# EAGLE board Keyboard_C64_HotSwap (EAGLE 9.6.0)
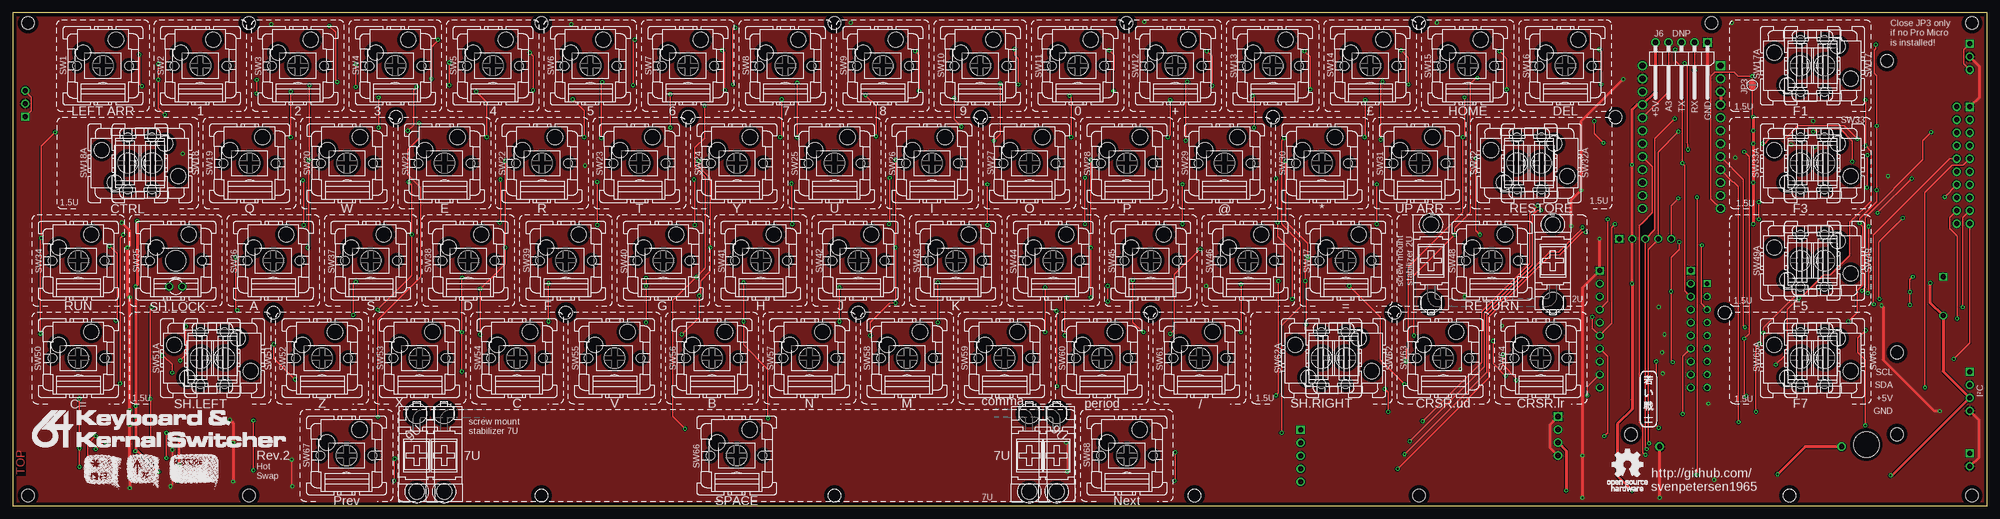
[diagram p1: board, top side]
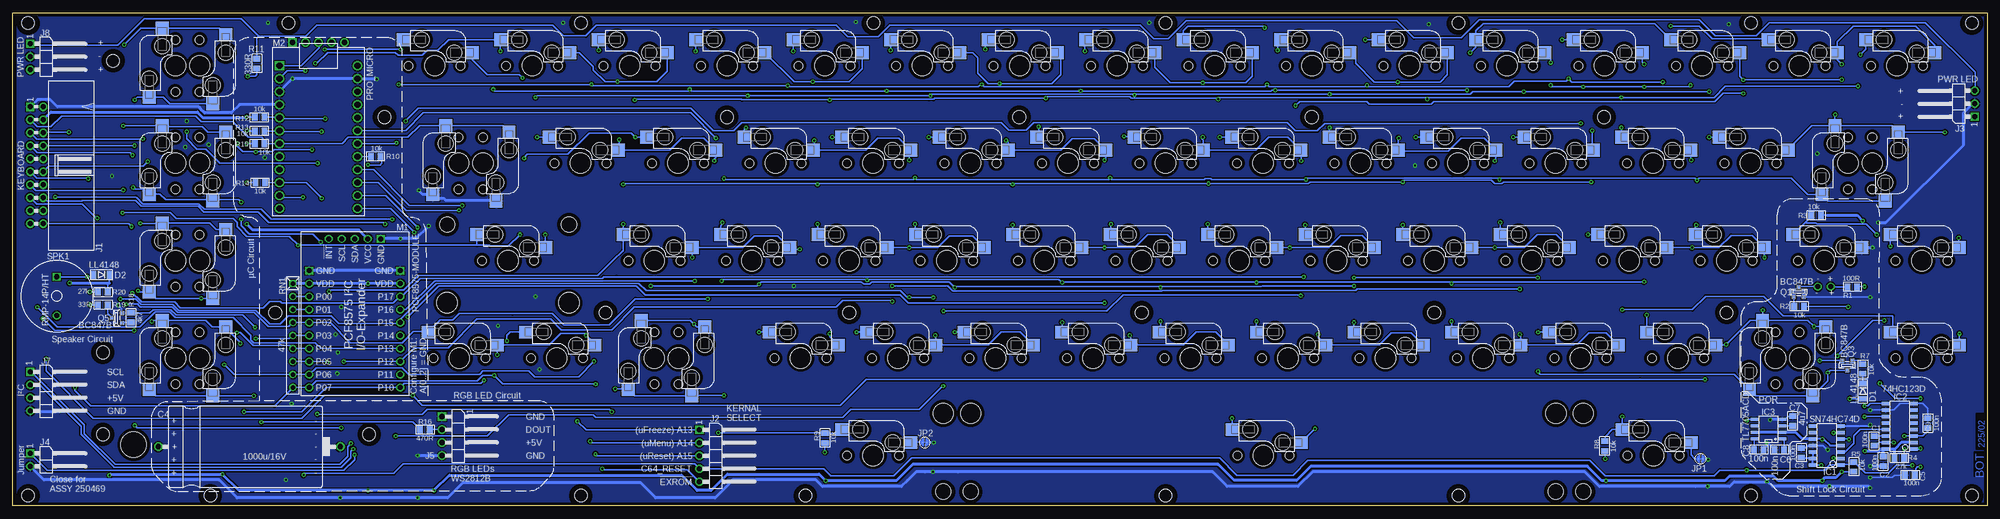
[diagram p2: board, bottom side, seen from below]

Size 385.6 x 96.4 mm. Coordinates in mm from the lower left corner, seen from the top.
Outline: 0,0 385.6,0 385.6,96.4 0,96.4 0,0
Copper layers (1*16): Top 0.035mm / dielectric 1.5mm / Bottom 0.035mm
Design rules "default *": minimum track width 6mil, minimum drill 0.35mm, track to track 6mil, track to pad 6mil, pad to pad 6mil, via to via 6mil, smd to smd 6mil, copper to edge 25mil, drill to drill 6mil, minimum pad ring 10mil, minimum via ring 8mil, stop-mask expansion 4mil, vias tented up to drill 25mil, thermal gap 10mil
Holes 2.5 mm at 3,94.4 3,2 46.16,94.4 103.29,94.4 160.44,94.4 217.52,94.4 274.64,94.4 331.76,94.4 382.6,94.4 46.16,2 103.29,2 160.44,2 274.64,2 347,2 382.6,2 74.8,76 131.92,76 189.04,76 246.14,76 313,76 50.88,37.8 108,37.8 165.12,37.8 222.24,37.8 269.84,37.8 334.34,37.8 230.8,2 366,87 368,30 368,14 316,14
Holes 5 mm at 362,12
tRestrict: area 1,92.4 to 5,96.4; area 44.2,92.4 to 48.2,96.4; area 101.3,92.4 to 105.3,96.4; area 158.4,92.4 to 162.4,96.4; area 215.5,92.4 to 219.5,96.4; area 272.6,92.4 to 276.6,96.4; area 329.8,92.4 to 333.8,96.4; area 380.6,92.4 to 384.6,96.4; area 72.8,74 to 76.8,78; area 129.9,74 to 133.9,78; area 187,74 to 191,78; area 244.1,74 to 248.1,78; area 311,74 to 315,78; area 48.9,35.8 to 52.9,39.8; area 106,35.8 to 110,39.8; area 163.1,35.8 to 167.1,39.8; area 220.2,35.8 to 224.2,39.8; area 267.8,35.8 to 271.8,39.8; area 332.3,35.8 to 336.3,39.8; area 380.6,0 to 384.6,4; area 272.6,0 to 276.6,4; area 158.4,0 to 162.4,4; area 101.3,0 to 105.3,4; area 44.2,0 to 48.2,4; area 1,0 to 5,4; area 345,0 to 349,4; area 82.2,0.8 to 86.2,4.8; area 196.5,0.8 to 200.5,4.8; area 275,53 to 279,57; area 298.8,53 to 302.8,57; area 76.8,0.8 to 80.8,4.8; area 201.8,0.8 to 205.8,4.8; area 228.8,0 to 232.8,4; area 364,85 to 368,89; area 366,28 to 370,32; area 366,12 to 370,16; area 314,12 to 318,16
bRestrict: area 1,92.4 to 5,96.4; area 44.2,92.4 to 48.2,96.4; area 101.3,92.4 to 105.3,96.4; area 158.4,92.4 to 162.4,96.4; area 215.5,92.4 to 219.5,96.4; area 272.6,92.4 to 276.6,96.4; area 329.8,92.4 to 333.8,96.4; area 380.6,92.4 to 384.6,96.4; area 72.8,74 to 76.8,78; area 129.9,74 to 133.9,78; area 187,74 to 191,78; area 244.1,74 to 248.1,78; area 311,74 to 315,78; area 48.9,35.8 to 52.9,39.8; area 106,35.8 to 110,39.8; area 163.1,35.8 to 167.1,39.8; area 220.2,35.8 to 224.2,39.8; area 267.8,35.8 to 271.8,39.8; area 332.3,35.8 to 336.3,39.8; area 380.6,0 to 384.6,4; area 272.6,0 to 276.6,4; area 158.4,0 to 162.4,4; area 101.3,0 to 105.3,4; area 44.2,0 to 48.2,4; area 1,0 to 5,4; area 345,0 to 349,4; area 82.2,0.8 to 86.2,4.8; area 196.5,0.8 to 200.5,4.8; area 275,53 to 279,57; area 298.8,53 to 302.8,57; area 76.8,0.8 to 80.8,4.8; area 201.8,0.8 to 205.8,4.8; area 228.8,0 to 232.8,4; area 364,85 to 368,89; area 366,28 to 370,32; area 366,12 to 370,16; area 314,12 to 318,16; 3 lines

## Footprints (pad centres in the part's own frame; a part is rotated, then mirrored left to right if it is on the bottom)
0805 = smd 1.092 x 1.397: 1 -0.94,0; 2 0.94,0
C30X16L = drill 1.016 pad 1.651: A -17.78,0; K 17.78,0
SOD80C = smd 1 x 1.6: A -1.5,0; K 1.5,0
SO-14 = smd 0.61 x 1.524: 1 -3.81,-2.794; 2 -2.54,-2.794; 3 -1.27,-2.794; 4 0,-2.794; 5 1.27,-2.794; 6 2.54,-2.794; 7 3.81,-2.794; 8 3.81,2.667; 9 2.54,2.667; 10 1.27,2.667; 11 0,2.667; 12 -1.27,2.667; 13 -2.54,2.667; 14 -3.81,2.667
SO-16 = smd 0.61 x 1.524: 1 -3.81,-2.819; 2 -2.54,-2.819; 3 -1.27,-2.819; 4 0,-2.819; 5 1.27,-2.819; 6 2.54,-2.819; 7 3.81,-2.819; 8 5.08,-2.819; 9 5.08,2.692; 10 3.81,2.692; 11 2.54,2.692; 12 1.27,2.692; 13 0,2.692; 14 -1.27,2.692; 15 -2.54,2.692; 16 -3.81,2.692
SO8 = smd 0.6 x 1.5: 1 -1.905,-2.699; 2 -0.635,-2.699; 3 0.635,-2.699; 4 1.905,-2.699; 5 1.905,2.699; 6 0.635,2.699; 7 -0.635,2.699; 8 -1.905,2.699
2X10WH = drill 1 pad 1.626 square: 1 -11.43,-1.27 | drill 1 pad 1.626: 2 -11.43,1.27; 3 -8.89,-1.27; 4 -8.89,1.27; 5 -6.35,-1.27; 6 -6.35,1.27; 7 -3.81,-1.27; 8 -3.81,1.27; 9 -1.27,-1.27; 10 -1.27,1.27; 11 1.27,-1.27; 12 1.27,1.27; 13 3.81,-1.27; 14 3.81,1.27; 15 6.35,-1.27; 16 6.35,1.27; 17 8.89,-1.27; 18 8.89,1.27; 19 11.43,-1.27; 20 11.43,1.27
1X05/90 = drill 1 pad 1.626 square: 1 -5.08,0 | drill 1 pad 1.626: 2 -2.54,0; 3 0,0; 4 2.54,0; 5 5.08,0
1X03/90 = drill 1 pad 1.626 square: 1 -2.54,0 | drill 1 pad 1.626: 2 0,0; 3 2.54,0
1X02/90 = drill 1 pad 1.626 square: 1 -1.27,0 | drill 1 pad 1.626: 2 1.27,0
1X04/90 = drill 1 pad 1.626 square: 1 -3.81,0 | drill 1 pad 1.626: 2 -1.27,0; 3 1.27,0; 4 3.81,0
CP_CL = smd 0.152 x 0.152: 1 -0.4,0; 2 0.4,0
CP_OP = smd 0.152 x 0.152: 1 -0.4,0; 2 0.4,0
PCF8575MODUL = drill 1 square: A1 -8.89,-8.5; B1 8.89,-8.5; C1 -5.08,-14.7 | drill 1: A2 -8.89,-5.96; A3 -8.89,-3.42; A4 -8.89,-0.88; A5 -8.89,1.66; A6 -8.89,4.2; A7 -8.89,6.74; A8 -8.89,9.28; A9 -8.89,11.82; A10 -8.89,14.36; B2 8.89,-5.96; B3 8.89,-3.42; B4 8.89,-0.88; B5 8.89,1.66; B6 8.89,4.2; B7 8.89,6.74; B8 8.89,9.28; B9 8.89,11.82; B10 8.89,14.36; C2 -2.54,-14.7; C3 0,-14.7; C4 2.54,-14.7; C5 5.08,-14.7
PRO_MICRO = drill 1.2 square: 1 -7.62,13.97 | drill 1.2: 2 -7.62,11.43; 3 -7.62,8.89; 4 -7.62,6.35; 5 -7.62,3.81; 6 -7.62,1.27; 7 -7.62,-1.27; 8 -7.62,-3.81; 9 -7.62,-6.35; 10 -7.62,-8.89; 11 -7.62,-11.43; 12 -7.62,-13.97; 13 7.62,-13.97; 14 7.62,-11.43; 15 7.62,-8.89; 16 7.62,-6.35; 17 7.62,-3.81; 18 7.62,-1.27; 19 7.62,1.27; 20 7.62,3.81; 21 7.62,6.35; 22 7.62,8.89; 23 7.62,11.43; 24 7.62,13.97
SOT23 = smd 0.8 x 0.9: 1 -0.953,-0.953; 2 0.953,-0.953; 3 0,0.953
RN-9 = drill 0.889 pad 1.397 square: 1 -10.16,0 | drill 0.889 pad 1.397: 2 -7.62,0; 3 -5.08,0; 4 -2.54,0; 5 0,0; 6 2.54,0; 7 5.08,0; 8 7.62,0; 9 10.16,0
RMP-14P/HT = drill 1 square: 1 0,3.8 | drill 1: 2 0,-3.8
CHERRYMX_HOTSWAP = smd 2.55 x 2.5 bottom: 1 -7.366,2.54; 2 6.096,5.08 | hole 4: 0,0 | hole 1.7: 5.08,0; -5.08,0 | hole 3: -3.81,2.54; 2.54,5.08
CHERRYMX_HSWP_LD = smd 2.55 x 2.5 bottom: 1 -7.366,2.54; 2 6.096,5.08 | drill 1: LDA -1.27,-5.08; LDC 1.27,-5.08 | hole 4: 0,0 | hole 1.7: 5.08,0; -5.08,0 | hole 3: -3.81,2.54; 2.54,5.08
STABIL_PIN_SCREW_L = hole 3: 0,7.05 | hole 4: 0,-8.24
STABIL_PIN_SCREW = hole 3: 0,7.05 | hole 4: 0,-8.24

## Placement (x,y rotation side)
C1  100n  [0805]  22.07,12.7 90 bottom
C2  100n  [0805]  20.32,8.73 90 bottom
C3  100n  [0805]  36.3,10.4 270 bottom
C4  1000u/16V  [C30X16L]  339.41,11.59 0 bottom
C5  100n  [0805]  15.08,6.03 0 bottom
C6  100n  [0805]  40.6,11 0 bottom
C7  4u7  [0805]  38,16.6 270 bottom
C8  100n  [0805]  44.6,11 0 bottom
C9  100n  [0805]  11.59,16.19 90 bottom
D1  LL4148  [SOD80C]  24.3,22.4 90 bottom
D2  LL4148  [SOD80C]  368.26,45.17 0 bottom
IC1  SN74HC74D  [SO-14]  31.4,11.8 90 bottom
IC2  74HC123D  [SO-16]  17.14,14.92 90 bottom
IC3  TL7705ACD  [SO8]  42.7,15 90 bottom
J1  [2X10WH]  380.93,66.6 270 bottom
J2  [1X05/90]  251.5,9.8 270 bottom
J3  [1X03/90]  2.42,78.62 90 bottom
J4  [1X02/90]  382.2,9 270 bottom
J5  [1X04/90]  301.78,13.65 270 bottom
J6  [1X05/90]  325.9,90.6 180 top
J7  [1X04/90]  382.2,22.4 270 bottom
J8  [1X03/90]  382.2,87.8 270 bottom
JP1  [CP_CL]  55.97,9.23 180 bottom
JP2  [CP_CL]  207.5,12.4 180 bottom
JP3  [CP_OP]  339.74,82.26 270 top
M1  PCF8575-MODULE  [PCF8575MODUL]  318.8,37.5 180 bottom
M2  PRO_MICRO  [PRO_MICRO]  325.9,72.1 0 bottom
Q1  BC847B  [SOT23]  36.79,41.82 0 bottom
Q3  BC847B  [SOT23]  27.34,27.48 180 bottom
Q5  BC847B  [SOT23]  365.26,36.73 90 bottom
R1  100R  [0805]  26.37,42.82 0 bottom
R2  10k  [0805]  36.75,39.02 0 bottom
R3  10k  [0805]  33.43,56.82 0 bottom
R4  27k  [0805]  17.14,9.37 180 bottom
R5  10k  [0805]  26.04,7.62 270 bottom
R7  10k  [0805]  24.3,26.8 90 bottom
R8  10k  [0805]  74.7,11.7 270 bottom
R9  10k  [0805]  226.98,13.26 270 bottom
R10  10k  [0805]  314.7,68.3 180 bottom
R11  330R  [0805]  337.95,86.48 270 bottom
R12  10k  [0805]  337.4,76 180 bottom
R13  10k  [0805]  337.4,73.3 180 bottom
R14  10k  [0805]  337.3,63.2 180 bottom
R15  10k  [0805]  337.4,70.8 180 bottom
R16  470R  [0805]  305.12,14.92 0 bottom
R18  4k7  [0805]  362.53,36.81 90 bottom
R19  33R  [0805]  368,39.3 0 bottom
R20  27k  [0805]  368,41.8 0 bottom
RN1  47k  [RN-9]  330.9,33.3 270 bottom
SPK1  RMP-14P/HT  [RMP-14P/HT]  377,41 0 bottom
SW1  MXHOTSWAP  [CHERRYMX_HOTSWAP]  17.6,86.05 0 top
SW2  MXHOTSWAP  [CHERRYMX_HOTSWAP]  36.64,86.05 0 top
SW3  MXHOTSWAP  [CHERRYMX_HOTSWAP]  55.68,86.05 0 top
SW4  MXHOTSWAP  [CHERRYMX_HOTSWAP]  74.72,86.05 0 top
SW5  MXHOTSWAP  [CHERRYMX_HOTSWAP]  93.76,86.05 0 top
SW6  MXHOTSWAP  [CHERRYMX_HOTSWAP]  112.8,86.05 0 top
SW7  MXHOTSWAP  [CHERRYMX_HOTSWAP]  131.84,86.05 0 top
SW8  MXHOTSWAP  [CHERRYMX_HOTSWAP]  150.88,86.05 0 top
SW9  MXHOTSWAP  [CHERRYMX_HOTSWAP]  169.92,86.05 0 top
SW10  MXHOTSWAP  [CHERRYMX_HOTSWAP]  188.96,86.05 0 top
SW11  MXHOTSWAP  [CHERRYMX_HOTSWAP]  208,86.05 0 top
SW12  MXHOTSWAP  [CHERRYMX_HOTSWAP]  227.04,86.05 0 top
SW13  MXHOTSWAP  [CHERRYMX_HOTSWAP]  246.08,86.05 0 top
SW14  MXHOTSWAP  [CHERRYMX_HOTSWAP]  265.12,86.05 0 top
SW15  MXHOTSWAP  [CHERRYMX_HOTSWAP]  284.16,86.05 0 top
SW16  MXHOTSWAP  [CHERRYMX_HOTSWAP]  303.2,86.05 0 top
SW17  MXHOTSWAP  [CHERRYMX_HOTSWAP]  353.85,86.05 270 top
SW17A  MXHOTSWAP  [CHERRYMX_HOTSWAP]  349.1,86.05 90 top
SW18  MXHOTSWAP  [CHERRYMX_HOTSWAP]  27.2,67 270 top
SW18A  MXHOTSWAP  [CHERRYMX_HOTSWAP]  22.45,67 90 top
SW19  MXHOTSWAP  [CHERRYMX_HOTSWAP]  46.24,67 0 top
SW20  MXHOTSWAP  [CHERRYMX_HOTSWAP]  65.28,67 0 top
SW21  MXHOTSWAP  [CHERRYMX_HOTSWAP]  84.32,67 0 top
SW22  MXHOTSWAP  [CHERRYMX_HOTSWAP]  103.36,67 0 top
SW23  MXHOTSWAP  [CHERRYMX_HOTSWAP]  122.4,67 0 top
SW24  MXHOTSWAP  [CHERRYMX_HOTSWAP]  141.44,67 0 top
SW25  MXHOTSWAP  [CHERRYMX_HOTSWAP]  160.48,67 0 top
SW26  MXHOTSWAP  [CHERRYMX_HOTSWAP]  179.52,67 0 top
SW27  MXHOTSWAP  [CHERRYMX_HOTSWAP]  198.56,67 0 top
SW28  MXHOTSWAP  [CHERRYMX_HOTSWAP]  217.6,67 0 top
SW29  MXHOTSWAP  [CHERRYMX_HOTSWAP]  236.64,67 0 top
SW30  MXHOTSWAP  [CHERRYMX_HOTSWAP]  255.68,67 0 top
SW31  MXHOTSWAP  [CHERRYMX_HOTSWAP]  274.72,67 0 top
SW32  MXHOTSWAP  [CHERRYMX_HOTSWAP]  293.76,67 90 top
SW32A  MXHOTSWAP  [CHERRYMX_HOTSWAP]  298.51,67 270 top
SW33  MXHOTSWAP  [CHERRYMX_HOTSWAP]  353.85,67 270 top
SW33A  MXHOTSWAP  [CHERRYMX_HOTSWAP]  349.1,67 90 top
SW34  MXHOTSWAP  [CHERRYMX_HOTSWAP]  12.8,47.95 0 top
SW35  MX+LEDHSWP  [CHERRYMX_HSWP_LD]  31.84,47.95 0 top
SW36  MXHOTSWAP  [CHERRYMX_HOTSWAP]  50.88,47.95 0 top
SW37  MXHOTSWAP  [CHERRYMX_HOTSWAP]  69.92,47.95 0 top
SW38  MXHOTSWAP  [CHERRYMX_HOTSWAP]  88.96,47.95 0 top
SW39  MXHOTSWAP  [CHERRYMX_HOTSWAP]  108,47.95 0 top
SW40  MXHOTSWAP  [CHERRYMX_HOTSWAP]  127.04,47.95 0 top
SW41  MXHOTSWAP  [CHERRYMX_HOTSWAP]  146.08,47.95 0 top
SW42  MXHOTSWAP  [CHERRYMX_HOTSWAP]  165.12,47.95 0 top
SW43  MXHOTSWAP  [CHERRYMX_HOTSWAP]  184.16,47.95 0 top
SW44  MXHOTSWAP  [CHERRYMX_HOTSWAP]  203.2,47.95 0 top
SW45  MXHOTSWAP  [CHERRYMX_HOTSWAP]  222.24,47.95 0 top
SW46  MXHOTSWAP  [CHERRYMX_HOTSWAP]  241.28,47.95 0 top
SW47  MXHOTSWAP  [CHERRYMX_HOTSWAP]  260.32,47.95 0 top
SW48  MXHOTSWAP  [CHERRYMX_HOTSWAP]  288.88,47.95 0 top
SW49  MXHOTSWAP  [CHERRYMX_HOTSWAP]  353.85,47.95 270 top
SW49A  MXHOTSWAP  [CHERRYMX_HOTSWAP]  349.1,47.95 90 top
SW50  MXHOTSWAP  [CHERRYMX_HOTSWAP]  12.8,28.9 0 top
SW51  MXHOTSWAP  [CHERRYMX_HOTSWAP]  41.36,28.9 270 top
SW51A  MXHOTSWAP  [CHERRYMX_HOTSWAP]  36.61,28.9 90 top
SW52  MXHOTSWAP  [CHERRYMX_HOTSWAP]  60.4,28.9 0 top
SW53  MXHOTSWAP  [CHERRYMX_HOTSWAP]  79.44,28.9 0 top
SW54  MXHOTSWAP  [CHERRYMX_HOTSWAP]  98.48,28.9 0 top
SW55  MXHOTSWAP  [CHERRYMX_HOTSWAP]  117.52,28.9 0 top
SW56  MXHOTSWAP  [CHERRYMX_HOTSWAP]  136.56,28.9 0 top
SW57  MXHOTSWAP  [CHERRYMX_HOTSWAP]  155.6,28.9 0 top
SW58  MXHOTSWAP  [CHERRYMX_HOTSWAP]  174.64,28.9 0 top
SW59  MXHOTSWAP  [CHERRYMX_HOTSWAP]  193.68,28.9 0 top
SW60  MXHOTSWAP  [CHERRYMX_HOTSWAP]  212.72,28.9 0 top
SW61  MXHOTSWAP  [CHERRYMX_HOTSWAP]  231.76,28.9 0 top
SW62  MXHOTSWAP  [CHERRYMX_HOTSWAP]  260.32,28.9 270 top
SW62A  MXHOTSWAP  [CHERRYMX_HOTSWAP]  255.57,28.9 90 top
SW63  MXHOTSWAP  [CHERRYMX_HOTSWAP]  279.36,28.9 0 top
SW64  MXHOTSWAP  [CHERRYMX_HOTSWAP]  298.4,28.9 0 top
SW65  MXHOTSWAP  [CHERRYMX_HOTSWAP]  353.85,28.9 270 top
SW65A  MXHOTSWAP  [CHERRYMX_HOTSWAP]  349.1,28.9 90 top
SW66  MXHOTSWAP  [CHERRYMX_HOTSWAP]  141.38,9.85 0 top
SW67  MXHOTSWAP  [CHERRYMX_HOTSWAP]  65.18,9.85 0 top
SW68  MXHOTSWAP  [CHERRYMX_HOTSWAP]  217.58,9.85 0 top
U$90  OPEN_SOURCE_HW  [OPENHW]  311.4,2.88 0 top
U$92  [KCAP_1_5U]  349.1,86.05 0 top
U$93  [KCAP_1_5U]  349.1,67 0 top
U$94  [KCAP_1_5U]  349.1,47.95 0 top
U$95  [KCAP_1_5U]  349.1,28.9 0 top
U$96  [KCAP_1_5U]  255.57,28.9 0 top
U$97  [KCAP_1_5U]  22.45,67 0 top
U$98  [KCAP_1_5U]  36.61,28.9 0 top
U$99  [KCAP_1U]  65.18,9.85 0 top
U$100  [KCAP_1U]  217.58,9.85 0 top
U$101  [KCAP_1U]  17.6,86.05 0 top
U$102  [KCAP_1U]  303.2,86.05 0 top
U$103  [KCAP_1U]  298.4,28.9 0 top
U$104  [KCAP_7U]  141.38,9.85 0 top
U$105  [KCAP_2U]  288.88,47.95 0 top
U$106  [KCAP_1_5U]  298.51,67 0 top
U$107  [KCAP_1U]  12.8,47.95 0 top
U$108  [KCAP_1U]  12.8,28.9 0 top
U$109  [KCAP_1U]  36.64,86.05 0 top
U$110  [KCAP_1U]  55.68,86.05 0 top
U$111  [KCAP_1U]  74.72,86.05 0 top
U$112  [KCAP_1U]  93.76,86.05 0 top
U$113  [KCAP_1U]  112.8,86.05 0 top
U$114  [KCAP_1U]  131.84,86.05 0 top
U$115  [KCAP_1U]  150.88,86.05 0 top
U$116  [KCAP_1U]  169.92,86.05 0 top
U$117  [KCAP_1U]  188.96,86.05 0 top
U$118  [KCAP_1U]  208,86.05 0 top
U$119  [KCAP_1U]  227.04,86.05 0 top
U$120  [KCAP_1U]  246.08,86.05 0 top
U$121  [KCAP_1U]  265.12,86.05 0 top
U$122  [KCAP_1U]  284.16,86.05 0 top
U$123  [KCAP_1U]  46.24,67 0 top
U$124  [KCAP_1U]  65.28,67 0 top
U$125  [KCAP_1U]  84.32,67 0 top
U$126  [KCAP_1U]  103.36,67 0 top
U$127  [KCAP_1U]  122.4,67 0 top
U$128  [KCAP_1U]  141.44,67 0 top
U$129  [KCAP_1U]  160.48,67 0 top
U$130  [KCAP_1U]  179.52,67 0 top
U$131  [KCAP_1U]  198.56,67 0 top
U$132  [KCAP_1U]  217.6,67 0 top
U$133  [KCAP_1U]  236.64,67 0 top
U$134  [KCAP_1U]  255.68,67 0 top
U$135  [KCAP_1U]  274.72,67 0 top
U$136  [KCAP_1U]  50.88,47.95 0 top
U$137  [KCAP_1U]  69.92,47.95 0 top
U$138  [KCAP_1U]  88.96,47.95 0 top
U$139  [KCAP_1U]  108,47.95 0 top
U$140  [KCAP_1U]  127.04,47.95 0 top
U$141  [KCAP_1U]  146.08,47.95 0 top
U$142  [KCAP_1U]  165.12,47.95 0 top
U$143  [KCAP_1U]  184.16,47.95 0 top
U$144  [KCAP_1U]  203.2,47.95 0 top
U$145  [KCAP_1U]  222.24,47.95 0 top
U$146  [KCAP_1U]  241.28,47.95 0 top
U$147  [KCAP_1U]  260.32,47.95 0 top
U$148  [KCAP_1U]  31.84,47.95 0 top
U$149  [KCAP_1U]  60.4,28.9 0 top
U$150  [KCAP_1U]  79.44,28.9 0 top
U$151  [KCAP_1U]  98.48,28.9 0 top
U$152  [KCAP_1U]  117.52,28.9 0 top
U$153  [KCAP_1U]  136.56,28.9 0 top
U$154  [KCAP_1U]  155.6,28.9 0 top
U$155  [KCAP_1U]  174.64,28.9 0 top
U$156  [KCAP_1U]  193.68,28.9 0 top
U$157  [KCAP_1U]  212.72,28.9 0 top
U$158  [KCAP_1U]  231.76,28.9 0 top
U$159  [KCAP_1U]  279.36,28.9 0 top
U$161  [2LAYER]  2.32,6.05 90 top
U$162  [PCB-TITLE/]  -0.16,128.59 0 top  (outside the outline)
U$164  [C64_KEYS]  13.83,2.65 0 top
U$172  [STABIL_PIN_SCREW_L]  276.98,47.95 0 top
U$173  [STABIL_PIN_SCREW]  300.78,47.94 0 top
U$174  [STABIL_PIN_SCREW]  84.23,9.85 180 top
U$175  [STABIL_PIN_SCREW_L]  198.53,9.85 180 top
U$176  [64KB]  3.8,11.5 0 top
U$178  [SVEN_TAG]  319.5,21 0 top
U$180  [STABIL_PIN_SCREW]  78.88,9.85 180 top
U$181  [STABIL_PIN_SCREW_L]  203.88,9.85 180 top

## Tracks (layer width: path | path; a pad name or v marks a point on that pad's centre or on a via)
!C64RES  (via drill 0.35)
  Top 0.254: v328.8,6.05 328.93,6.18 v328.93,60.33 | v46.99,16.67 46.99,7.98 | 46.99,7.94 46.99,7.98 | 46.99,7.94 46.99,7.98 | v46.99,6.99 46.99,7.94 | v14.61,7.94 14.61,12.06 v16.19,13.65
  Bottom 0.254: v328.8,6.05 328.49,6.37 311.18,6.37 309.34,8.21 252.45,8.21 J2.4 227.21,7.26 225.82,5.87 213.51,5.87 210.01,9.37 149.86,9.37 146.53,6.03 135.57,6.03 132.72,8.89 77.63,8.89 74.61,5.87 53.34,5.87 52.23,6.99 v46.99,6.99 46.67,6.99 31.75,6.99 30.75,7.99 IC1.1 28.45,8.15 26.45,8.15 R5.1 25.86,8.56 23.81,6.51 19.21,6.51 17.78,7.94 v14.61,7.94 | IC3.5 46.75,16.91 v46.99,16.67 | v328.93,60.33 333.18,60.33 M2.11 | C9.1 11.59,14.61 12.54,13.65 IC2.3 v16.19,13.65
!EXROM  (via drill 0.35)
  Top 0.254: v270.46,7.24 288.29,25.07 288.29,36.99 294.32,43.02 300.38,49.08 302.08,49.08 306.5,53.5 v307.2,53.5
  Bottom 0.254: J2.5 253.88,7.1 270.32,7.1 v270.46,7.24 | v307.2,53.5 311.81,58.1 311.81,58.13 M2.13
!INT6  (via drill 0.35)
  Top 0.254: M1.C5 323.88,58.72 v325.29,60.12
  Bottom 0.254: R14.1 M2.10 | M2.10 328.33,63.2 325.29,60.16 v325.29,60.12 | M2.10
!LOCK  (via drill 0.35)
  Top 0.254: v20.95,23.97 20.95,52.39 v21.59,53.02 | v13.02,20.99 v13.02,11.27 v13.02,7.62
  Bottom 0.254: v20.95,23.97 17.98,20.99 v13.02,20.99 | SW35.2 35.48,55.48 | 35.48,55.48 34.38,56.58 33.97,56.99 34.2,56.99 R3.1 | IC2.1 13.18,11.11 v13.02,11.27 | C5.2 13.97,6.2 13.97,7.3 13.65,7.62 v13.02,7.62 | v21.59,53.02 23.63,55.06 33.22,55.06 33.44,55.29 35.29,55.29 35.48,55.48
!P1  (via drill 0.35)
  Top 0.254: v79.38,74.77 79.38,71.91 77.15,69.69 77.15,64.77 79.69,62.23 79.69,44.77 71.28,36.35 v71.28,17.46 | v308.86,75.25 308.86,72.77 v310.67,70.96
  Bottom 0.254: v79.38,74.77 129.38,74.77 130.81,73.34 135.1,73.34 136.68,74.93 186.21,74.93 187.68,73.47 191.07,73.47 192.53,74.93 243.21,74.93 244.79,73.34 248.76,73.34 253.21,77.79 306.39,77.79 308.86,75.31 v308.86,75.25 | v310.67,70.96 310.83,70.8 318.25,70.8 M2.18 | R8.1 74.61,12.7 74.61,13.49 73.18,14.92 72.41,14.92 72.41,14.93 SW67.2 71.28,17.3 v71.28,17.46
!P2  (via drill 0.35)
  Top 0.254: v248.28,71.91 247.81,71.44 247.81,55.09 251.46,51.44 251.46,38.89 247.81,35.24 v247.81,14.29
  Bottom 0.254: v248.28,71.91 253.21,76.83 305.44,76.83 308.9,73.37 M2.19 | SW68.2 223.83,14.93 224.56,14.2 R9.1 227.07,14.29 v247.81,14.29
!RESTORE
  Bottom 0.254: R15.1 336.39,70.8 | 336.39,70.8 333.55,70.8 M2.7 321.3,70.83 320.05,72.07 308.45,72.07 306.16,74.37 SW32A.1 289.95,74.37 SW32.2 | 336.39,70.8 336.55,70.96 336.55,71.6 337.03,72.07 339.6,72.07 342.42,74.9 342.42,74.93 342.58,75.09 348.77,75.09 349.25,75.56 349.88,76.2 376.08,76.2 378.14,74.14 380.85,74.14 J1.3
!SHORT_BRD  (via drill 0.35)
  Top 0.254: M2.17 320.2,66.37 320.2,57.31 318.29,55.4 317.66,54.77 317.66,54.45 317.66,16.35 318.29,15.72 318.29,10.41 318.7,10 v318.86,10
  Bottom 0.254: R10.2 M2.17 | v318.86,10 318.86,9.05 320.97,6.94 378.87,6.94 J4.1
+5V  (via drill 0.35)
  Top 0.254: v74.61,9.21 74.45,9.05 v74.45,4.92 | v227.01,10.48 227.01,5.08 v226.85,4.92 | v339.88,76.04 339.74,76.19 JP3.2
  Top 0.61: v32.23,13.02 32.38,12.86 v32.38,7.94 32.38,5.08 v32.23,4.92 | v24.29,55.72 24.29,43.18 v23.97,42.86 v23.97,19.53 v23.97,17.46 23.97,10.79 v23.89,10.72 24.37,10.72 v28.42,6.67 | v339.88,76.04 v339.88,73.34 v339.88,70.8 v339.88,63.18 v339.88,55.09 | v374.49,43.58 374.49,39.71 SPK1.2 377,26.33 J7.3 367.03,5.96 v366.73,5.96 | v316.23,3.02 313.37,5.87 313.37,16.03 316.23,18.89 316.23,20.8 v316.23,43.46 316.26,43.49 M1.C2 316.26,55.06 316.23,55.09 v316.23,66.67 316.23,77.47 317.21,78.45 M2.21 320.82,80.99 J6.5 | J5.3 303.37,10.79 v303.37,3.02 | C4.A 350.04,11.59 v344.65,6.19
  Bottom 0.254: R3.2 31.29,56.82 31.27,56.83 | v23.97,42.86 25.39,42.86 R1.2 | R9.2 226.98,12.26 227.01,12.25 v227.01,10.48 | R12.2 339.84,76 v339.88,76.04 | R13.2 339.84,73.3 v339.88,73.34 | R15.2 v339.88,70.8 | R20.2 367.06,43.55 367.03,43.58 | D2.K 366.76,43.63 366.71,43.58 | v316.23,66.67 313.85,66.67 313.53,66.99 313.53,68.07 R10.1 | R14.2 339.87,63.2 v339.88,63.18 | R5.2 28.4,6.68 v28.42,6.67 | IC2.9 22.86,20 23.34,19.53 v23.97,19.53 | IC2.11 v23.97,17.46 | v74.61,9.21 74.61,10.67 R8.2
  Bottom 0.406: IC1.13 IC1.14 32.44,7.99 v32.38,7.94 | IC1.4 30.69,11.8 31.91,13.02 v32.23,13.02 32.28,13.07 IC1.10 | IC1.13 36.1,9.26 C3.2 | IC1.12 IC1.13
  Bottom 0.61: 31.27,56.83 25.4,56.83 v24.29,55.72 | v28.42,6.67 29.53,5.56 31.59,5.56 v32.23,4.92 40.8,4.92 41.75,5.87 50.32,5.87 51.28,4.92 v74.45,4.92 75.25,4.92 78.11,7.78 132.08,7.78 134.87,4.99 147.09,5.01 150.18,8.1 209.86,8.1 213.03,4.92 v226.85,4.92 228.12,6.19 246.06,6.19 249.24,3.02 251.97,3.02 254.99,6.03 300.36,6.03 v303.37,3.02 v316.23,3.02 341.47,3.02 v344.65,6.19 366.5,6.19 v366.73,5.96 | RN1.1 M1.B2 v316.23,43.46 M1.A2 | J1.4 378.16,76.99 349.57,76.99 348.46,75.88 340.04,75.88 v339.88,76.04 | v374.49,43.58 367.03,43.58 366.71,43.58 | M1.C2 318.04,53.98 338.77,53.98 v339.88,55.09 | 20.32,11.11 IC2.16 18.1,11.11 | 20.32,11.11 20.8,11.11 21.27,10.64 23.81,10.64 v23.89,10.72 | IC2.2 16.83,12.38 18.1,11.11 | R4.2 18.09,11.1 18.1,11.11 | C2.2 20.32,11.11 | IC1.10 36.09,13.07 37.38,14.37 IC3.2 IC3.7
A3
  Top 0.254: M2.20 323.36,80.99 J6.4
COL0  (via drill 0.35)
  Top 0.254: v293.57,24.57 293.57,25.05 290.99,27.63 v290.99,29.53 | v286.05,83.68 285.91,83.82 284.64,82.55 284.64,57.31 281.62,54.29 v281.62,53.02 273.64,45.05 v273.64,33.31 | v358.46,36.04 360.2,37.78 360.2,42.07 361.31,43.18 361.31,54.61 v360.68,55.24 360.68,56.2 364.01,59.53 v364.01,61.75 v364.01,74.3 364.01,84.14 363.54,84.61 363.54,87.95 363.54,89.06 363.78,89.3 363.86,89.38 v363.86,90.17 | v341.15,31.75 340.44,31.04 v340.44,18.41
  Bottom 0.254: v293.57,24.57 294.21,23.93 309.12,23.93 M1.A10 324.41,23.14 329.13,18.41 339.65,18.41 v340.44,18.41 | J1.13 381.09,61.68 364.09,61.68 v364.01,61.75 | v281.62,53.02 281.62,50.6 SW48.1 | v286.05,83.68 286.67,84.3 292.89,84.3 295.83,87.24 SW16.1 | SW63.1 271.99,31.66 v273.64,33.31 274.03,33.7 278.56,33.7 280.83,31.43 SW64.1 | SW64.1 | v290.99,29.53 290.99,31.39 SW64.1 | SW17A.2 345.29,93.42 SW17.1 360.61,93.42 v363.86,90.17 | SW65A.2 344.17,35 | 344.17,35 346.62,35 347.89,36.27 SW65.1 358.23,36.27 v358.46,36.04 | v341.15,31.75 341.15,31.98 344.17,35 | SW49A.2 345.83,54.05 347.1,55.32 SW49.1 356.46,55.24 v360.68,55.24 | SW33A.2 347.57,73.1 348.62,74.14 356.08,74.14 356.35,74.41 | 356.35,74.41 SW33.1 | v364.01,74.3 356.46,74.3 356.35,74.41
COL1  (via drill 0.35)
  Top 0.254: v57.63,50.49 57.78,50.65 v57.78,67.63 57.94,67.79 v57.94,82.23 | v57.63,50.49 v57.63,50.48 v57.63,50.49 | v43.5,48.58 43.5,38.58 v43.81,38.26 | v307.5,21.59 307.5,23.27 M1.A9 | v379.1,28.73 382.2,31.84 J1.19 | v55.12,24.74 55.1,24.74 50.96,28.87 v50.96,31.6 | v66.99,86.36 v66.99,81.92 | v85.25,82.23 v85.25,86.68 | v77.15,73.34 78.26,74.45 78.26,81.28 v78.9,81.92 | v32.7,28.42 33.81,29.53 v33.81,35.08
  Bottom 0.254: SW37.1 v57.63,50.49 52.38,50.49 50.01,52.86 45.89,52.86 SW36.1 43.5,50.47 v43.5,48.58 | v379.1,28.73 379.1,26.35 369.89,17.14 329.17,17.14 324.73,21.59 v307.5,21.59 305.59,19.68 224,19.68 218.92,24.77 67.79,24.77 67.76,24.74 v55.12,24.74 | SW4.1 67.35,86.72 v66.99,86.36 | v85.25,82.23 84.93,81.92 v78.9,81.92 v66.99,81.92 58.26,81.92 v57.94,82.23 | v85.25,86.68 85.25,87.44 SW5.1 | SW20.1 57.91,67.76 v57.78,67.63 | SW21.1 77.15,69.74 v77.15,73.34 | v32.7,28.42 v32.69,28.43 Q3.2 | SW51A.2 31.62,35.08 v33.81,35.08 35,36.27 SW51.1 | SW52.1 51.12,31.44 v50.96,31.6 46.29,36.27 SW51.1 | SW51.1 43.81,36.35 v43.81,38.26
COL2  (via drill 0.35)
  Top 0.254: v379.72,36.64 v379.73,36.65 379.73,52.79 378.3,54.22 378.3,56.35 J1.18 | v114.94,71.91 114.94,82.71 v115.09,82.87 | v91.28,33.5 v91.28,42.39 96.2,47.31 v96.2,50.49 v96.2,67.47 | v213.84,43.02 v213.84,39.98 | v320.95,28.22 320.95,15.75 v321.47,15.24 | v361.79,15.72 361.79,27.78 361.79,28.57 360.36,30 360.36,32.81 361.79,34.24 v361.88,34.33
  Bottom 0.254: SW39.1 v96.2,50.49 90.39,50.49 87.86,53.02 84.13,53.02 SW38.1 | v320.95,28.22 M1.A8 307.21,30.92 300.55,30.92 294.96,36.51 280.51,36.51 278.45,34.45 268.61,34.45 264.2,38.85 225.2,38.86 224.82,38.86 223.52,40.16 214.02,40.16 v213.84,39.98 | SW6.1 105.43,84.27 106.84,82.87 v115.09,82.87 119.7,82.87 123.35,86.52 123.35,88.27 123.67,88.59 SW7.1 | v96.2,67.47 95.99,67.68 SW22.1 95.99,69.64 98.27,71.91 102.71,71.91 105.25,69.37 114.87,69.37 SW23.1 115.03,71.81 v114.94,71.91 | SW53.1 74.45,33.81 77.79,33.81 79.94,31.66 80.58,31.66 80.81,31.44 SW54.1 91.11,33.33 v91.28,33.5 | v91.28,42.39 123.03,42.39 123.35,42.07 161.15,42.07 161.18,42.05 202.07,42.05 203.04,43.02 v213.84,43.02 | v321.47,15.24 361.31,15.24 v361.79,15.72 | v379.72,36.64 377.41,34.33 v361.88,34.33
COL3  (via drill 0.35)
  Top 0.254: v380.81,38.85 380.84,38.85 380.84,56.35 J1.17 | v153.19,72.07 v153.19,82.71 | v133.99,67.47 133.99,66.36 136.21,64.14 v136.21,50.48 136.21,45.88 134.34,44.02 134.34,41.72 134.04,41.42 v134.04,41.1 134.04,36.89 v130.65,33.5 | M1.A7 311.47,29.21 311.47,14.29 v310.83,13.65 | v203.91,23.42 203.91,23.89 203.84,23.97 v203.84,38.1
  Bottom 0.254: v134.04,41.1 134.22,41.27 168.75,41.27 171.93,38.1 v203.84,38.1 | M1.A7 325.4,30.76 326.55,31.91 338.54,31.91 339.09,32.46 339.09,33.34 342.58,36.83 353.85,36.83 354.96,37.94 357.82,37.94 360.77,34.99 376.94,34.99 v380.81,38.85 | SW8.1 143.51,83.97 144.78,82.71 v153.19,82.71 159.54,82.71 162.55,85.72 SW9.1 | v153.19,72.07 153.35,71.91 153.35,71.75 153.11,71.52 SW25.1 142.87,69.54 140.34,72.07 136.61,72.07 SW24.1 133.99,69.45 v133.99,67.47 | SW41.1 v136.21,50.48 128.59,50.48 126.21,52.86 122.05,52.86 SW40.1 | SW55.1 112.53,33.81 116.36,33.81 118.74,31.44 SW56.1 130.65,32.9 v130.65,33.5 | v310.83,13.65 292.89,13.65 288.77,17.78 272.26,17.78 271.78,17.3 223.52,17.3 221.93,18.89 208.6,18.89 203.99,23.5 v203.91,23.42
COL4  (via drill 0.35)
  Top 0.254: v172.4,67.63 v172.4,50.48 v172.4,39.69 171.29,39.69 167.48,35.88 v167.48,33.34 | v312.9,55.09 312.26,54.45 312.26,35.65 M1.A6 308.48,34.73 v308.48,36.95 | v191.61,71.44 192.88,72.71 v192.88,82.57
  Bottom 0.254: v308.48,36.95 302.41,43.02 263.84,43.02 262.09,41.27 212.3,41.27 210.71,39.69 v172.4,39.69 | v312.9,55.09 313.21,55.4 335.6,55.4 337.66,57.47 348.3,57.47 349.41,58.58 360.52,58.58 361.63,59.69 372.03,59.69 372.11,59.61 378.91,59.61 379.55,60.25 J1.16 | SW10.1 181.59,88.41 180.97,87.79 180.97,84.3 182.72,82.55 192.88,82.55 | 192.88,82.55 195.1,82.55 197.17,84.61 197.17,87.63 198.13,88.59 SW11.1 | v172.4,67.63 172.15,67.88 SW26.1 174.42,71.8 178.71,71.8 180.97,69.54 SW27.1 191.19,71.02 v191.61,71.44 | SW43.1 v172.4,50.48 166.53,50.48 163.99,53.02 160.18,53.02 157.75,50.6 SW42.1 | SW57.1 148.23,31.55 150.65,33.97 154.46,33.97 157,31.44 SW58.1 167.27,33.13 v167.48,33.34 | 192.88,82.55 v192.88,82.57
COL5  (via drill 0.35)
  Top 0.254: v210.5,67.63 v210.5,50.48 v210.5,40.8 | v364.56,40.43 364.44,40.54 364.44,51.63 v369.11,56.3 | v229.08,71.44 229.08,82.55 229.39,82.87 v229.39,82.91 | v205.42,33.34 205.42,40.48 205.74,40.8 v205.82,40.72
  Bottom 0.254: J1.15 380.93,58.98 378.78,58.98 371.99,58.98 369.31,56.3 v369.11,56.3 | SW13.1 233.03,82.91 v229.39,82.91 222.28,82.91 219.71,85.48 219.71,88.58 220.03,88.9 219.98,88.9 SW12.1 | v210.5,67.63 210.5,69.27 SW28.1 212.61,71.91 216.69,71.91 219.07,69.54 SW29.1 229.08,69.74 v229.08,71.44 | SW45.1 v210.5,50.48 204.95,50.48 202.68,52.75 198.1,52.75 SW44.1 | SW59.1 188.85,33.97 192.56,33.97 195.1,31.44 SW60.1 205.35,33.27 v205.42,33.34 | v205.82,40.72 210.42,40.72 v210.5,40.8 211,40.8 212.27,42.07 261.92,42.07 263.35,43.5 302.89,43.5 309.91,36.48 M1.A5 310.03,35.72 321.94,35.72 323.37,37.15 330.2,37.15 331.79,37.15 333.38,35.56 335.44,35.56 338.14,38.26 353.22,38.26 354.33,39.37 360.52,39.37 361.58,40.43 v364.56,40.43
COL6  (via drill 0.35)
  Top 0.254: v248.6,67.47 248.6,55.56 252.89,51.28 v252.89,48.58 252.41,48.1 v252.41,43.97 252.57,43.81 v252.57,35.56 | J1.14 379.66,62.77 v377.29,60.41 | v311.47,56.04 311.47,39.94 M1.A4 | v267.18,71.6 267.18,82.55 267.49,82.87 v267.49,82.91 | v226.06,33.66 226.85,34.45 226.85,45.2 231.87,50.23 v231.93,50.16
  Bottom 0.254: M1.A4 308.81,38.38 303.22,43.97 v252.41,43.97 | v377.29,60.41 361.58,60.41 361.4,60.23 360.23,59.05 349.25,59.05 348.22,58.02 337.11,58.02 335.12,56.04 v311.47,56.04 | SW14.1 257.75,84.99 259.83,82.91 v267.49,82.91 269.88,82.91 272.19,85.22 272.19,85.82 274.96,88.59 SW15.1 | v248.6,67.47 248.6,67.79 248.31,68.08 SW30.1 250.69,71.91 254.95,71.91 257.33,69.54 SW31.1 267.18,69.72 v267.18,71.6 | v252.89,48.58 252.89,50.42 SW47.1 243.04,50.49 240.78,52.75 236.18,52.75 SW46.1 233.59,50.16 v231.93,50.16 | SW61.1 224.39,31.51 226.06,33.18 v226.06,33.66 | SW62A.2 252.01,35 v252.57,35.56 253.28,36.27 SW62.1
COL7  (via drill 0.35)
  Top 0.254: v29.69,76.52 28.42,77.79 v28.42,83.34 v28.42,86.36 | v5.4,33.66 5.4,52.23 v5.56,52.39 5.56,70.33 v8.26,73.03 | v47.62,83.29 47.62,80.65 v47.62,80.64 | v135.1,78.26 135.1,71.91 133.19,70.01 133.19,66.36 135.25,64.29 135.25,46.51 v133.51,44.77 128.91,40.16 128.91,17.46 v131.29,15.08 | v362.43,54.61 362.43,41.75 v362.27,41.59
  Bottom 0.254: v133.51,44.77 267.65,44.77 270.19,44.77 270.51,44.45 306.07,44.45 309.6,40.92 M1.A3 310.08,40.92 311.31,39.69 333.06,39.69 333.38,40.01 335.44,40.01 336.71,38.73 352.9,38.73 354.01,39.85 360.42,39.85 361.41,40.84 361.51,40.84 v362.27,41.59 | SW1.1 10.23,90.08 13.97,93.82 26.17,93.82 29.27,90.72 SW2.1 29.27,87.22 v28.42,86.36 | SW18.1 29.74,76.46 v29.69,76.52 | SW18.1 18.64,74.37 SW18A.2 17.3,73.03 v8.26,73.03 | SW18.1 34.22,74.37 38.87,69.71 SW19.1 | v28.42,83.34 28.47,83.29 v47.62,83.29 48.31,83.99 SW3.1 | SW50.1 5.43,33.62 v5.4,33.66 | v5.56,52.39 5.56,50.61 SW34.1 | v47.62,80.64 51.59,80.64 53.18,79.06 108.11,79.06 108.58,78.58 120.65,78.58 121.13,79.06 134.3,79.06 v135.1,78.26 | SW66.1 131.32,15.08 v131.29,15.08 | v362.43,54.61 362.99,55.17 J1.20
GND  (via drill 0.35)
  Top 0.254: v54.45,9.05 54.45,3.97 v54.61,3.81 | v205.74,12.38 205.9,12.22 v205.9,6.67
  Top 0.406: v31.11,10.95 31.11,4.13 v30.8,3.81
  Top 0.61: M2.3 M2.4 | v314.55,83.44 306.29,75.19 v306.29,61.7 304.39,59.8 v304.39,54.73 | v21.27,55.4 22.7,53.98 22.7,50.8 v22.38,50.48 22.38,41.27 v22.86,40.8 v22.86,18.73 v22.86,15.88 22.86,12.06 v22.86,7.78 v22.86,5.56 v22.86,3.49 | J8.2 384.02,85.98 384.02,79.85 J1.1 | v309.88,52.23 309.91,52.2 M1.A1 306.55,42.64 306.55,11.59 v306.55,9.84 v306.55,1.59 | J4.2 384.02,9.55 384.02,16.77 J7.4 | v364.97,39.21 365.28,38.89 365.28,28.57 375.32,18.53 v376.31,18.53 | J5.1 300.2,15.88 300.2,11.43 J5.4 | v330.98,83.53 J6.1 | v42.39,16.83 43.02,16.19 v43.02,12.38 v43.02,4.76 | v321.63,1.59 C4.K
  Bottom 0.254: Q1.2 22.93,40.87 v22.86,40.8 | v364.97,39.21 364.29,38.53 364.29,37.7 Q5.2 | JP1.1 54.63,9.23 v54.45,9.05 | IC2.10 v22.86,18.73 | C6.1 42.92,12.38 v43.02,12.38 43.02,11.64 C8.2 | C7.1 38.82,17.54 39.45,16.91 IC3.4 | C5.1 18.1,6.03 18.57,5.56 19.68,5.56 v22.86,5.56 | JP2.1 207.08,12.38 v205.74,12.38 | C9.2 11.59,19.05 12.54,20 IC2.8
  Bottom 0.305: IC2.8 16.99,20 18.26,18.73 IC2.10
  Bottom 0.406: IC1.7 23.12,15.61 v22.86,15.88 | C3.1 35.33,11.34 34.87,11.8 IC1.11 32.12,11.8 31.27,10.95 v31.11,10.95
  Bottom 0.61: M2.3 v330.98,83.53 M2.23 318.19,83.44 v314.55,83.44 | v304.39,54.73 v304.39,54.72 306.88,52.23 v309.88,52.23 313.69,52.23 M1.C1 | v21.27,55.4 19.78,55.4 4.6,70.58 4.6,76.83 2.81,78.62 J3.2 | SW35.1 v22.38,50.48 | v22.86,3.49 23.18,3.81 v30.8,3.81 41.91,3.81 42.86,4.76 v43.02,4.76 49.37,4.76 50.32,3.81 v54.61,3.81 56.99,3.81 75.72,3.81 78.58,6.67 131.76,6.67 134.62,3.81 148.43,3.81 151.29,6.67 200.98,6.67 v205.9,6.67 207.49,6.67 209.2,6.67 210.85,5.02 212.06,3.81 227.49,3.81 228.76,5.08 244.95,5.08 245.01,5.02 248.44,1.59 260.03,1.59 263.05,4.6 297.66,4.6 300.67,1.59 v306.55,1.59 v321.63,1.59 341.79,1.59 345.28,5.08 379.55,5.08 J4.2 | M2.4 341.29,78.45 342.9,76.83 348.14,76.83 348.85,77.55 349.33,78.03 376.87,78.03 378.3,79.46 380.77,79.46 J1.1 | M1.A1 M1.B1 | J7.4 382.14,18.53 v376.31,18.53 | v376.31,18.53 376.3,18.52 v376.31,18.53 | J5.4 v306.55,9.84 | C2.1 22.85,7.79 v22.86,7.78 | IC3.4 42.31,16.91 v42.39,16.83 | SW32.1 291.33,59.75 301.05,59.75 301.47,60.17 302.85,60.17 SW32A.2 305.54,60.9 306.29,61.66 v306.29,61.7
  other vias: 283.53,40.96 290.83,35.24 282.73,26.67 321.47,38.89 322.58,33.5 322.1,30 322.26,25.88 331.15,20 332.26,5.08 366.24,64.45 336.39,68.1 351.95,70.17 347.35,70.64 351.63,75.25 33.18,68.9 50.48,94.14 109.06,94.14 163.67,94.46 220.98,94.61 278.13,94.46 335.76,94.46 111.76,66.52 233.04,43.02
  pour Top: 0.5,0.5 0.5,95.8 385,95.8 385,0.5
  pour Bottom (isolate 0.254): 0.5,0.5 385,0.5 385,95.8 0.5,95.8
KSW_A13  (via drill 0.35)
  Top 0.254: v275.33,16.56 286.86,28.09 286.86,38.03 296.23,47.4 296.23,57.15 v297.81,58.74
  Bottom 0.254: J2.1 273.65,14.88 v275.33,16.56 | v297.81,58.74 308.13,58.74 315.15,65.75 M2.16
KSW_A14  (via drill 0.35)
  Top 0.254: v272.83,12.64 287.34,27.15 287.34,37.62 296.78,47.07 296.78,56.81 297.75,57.78 v298.45,57.78
  Bottom 0.254: J2.2 272.53,12.34 v272.83,12.64 | v298.45,57.78 308.77,57.78 314.19,63.21 M2.15
KSW_A15  (via drill 0.35)
  Top 0.254: v271.81,10.12 287.81,26.12 287.81,37.31 300.18,49.67 301.92,49.67 306.57,54.32 v306.57,54.45
  Bottom 0.254: J2.3 271.49,9.8 v271.81,10.12 | v306.57,54.45 306.57,54.47 312.74,60.64 318.25,60.64 M2.14
LOCK
  Bottom 0.254: IC1.3 28.55,10.58 27.68,10.58 26.04,12.22 26.04,13.65 24.77,14.92 IC2.13
N$1
  Bottom 0.254: R1.1 30.52,42.82 SW35.LDA
N$2
  Bottom 0.254: SW35.LDC 36.69,42.87 Q1.3
N$3
  Bottom 0.254: Q1.1 37.74,39.07 R2.1
N$4
  Bottom 0.254: IC2.14 22.05,13.65 C1.2
N$5  (via drill 0.35)
  Top 0.254: v30,9.37 v30,14.29
  Bottom 0.254: IC1.2 29.9,9.26 v30,9.37 | v30,14.29 28.66,14.29 IC1.6
N$7
  Bottom 0.254: R7.1 D1.K
N$8
  Bottom 0.254: R7.2 24.99,28.43 Q3.1
N$9
  Bottom 0.254: Q5.1 364.31,35.82 R18.1
N$10
  Top 0.254: J8.1 381,89.14 381,86.44 382.18,85.26 J8.3 | J3.3 3.65,79.93 3.65,77.32 J3.1
  Bottom 0.254: J3.3 2.38,81.28 2.38,84.77 12.06,94.46 42.55,94.46 45.09,91.92 53.08,91.92 56.23,95.07 99.15,95.07 102.7,91.52 111.99,91.52 115.34,94.87 156.4,94.87 159.91,91.36 162.79,91.36 165.42,93.98 166.37,93.98 214.31,93.98 216.53,91.76 222.57,91.76 224.79,93.98 225.11,93.98 271.62,93.98 273.69,91.92 278.13,91.92 280.19,93.98 326.23,93.98 328.37,91.84 329.33,91.84 337.58,91.84 | 337.58,91.84 341,95.25 359.89,95.25 365.1,90.04 381.9,90.04 J8.1 | R11.1 337.95,91.48 337.58,91.84
N$11
  Bottom 0.254: Q5.3 367.06,37.58 R19.2
N$12  (via drill 0.35)
  Top 0.254: v370.52,39.29 v370.52,41.83 370.52,44.23 v371.09,44.8
  Bottom 0.254: SPK1.1 v371.09,44.8 370.14,44.8 D2.A | v370.52,39.29 R19.1 | R20.1 368.97,41.83 v370.52,41.83
N$13
  Bottom 0.254: R16.2 J5.2
N$14
  Bottom 0.254: JP1.2 57.07,9.23 57.81,9.98 SW67.1
N$15
  Bottom 0.203: JP2.2 209.87,12.4
  Bottom 0.254: SW68.1 209.88,12.39 209.87,12.4
N$16  (via drill 0.35)
  Top 0.254: v16.19,11.11 17.46,12.38 v18.26,12.38
  Bottom 0.254: C1.1 22.05,11.75 21.75,11.75 21.11,12.38 IC2.15 v18.26,12.38 | R4.1 16.2,11.1 v16.19,11.11
N$17
  Bottom 0.254: C8.1 45.54,12.95 IC3.8
N$18
  Bottom 0.254: C6.2 39.66,12.75 IC3.1
N$19
  Bottom 0.254: C7.2 39.98,15.66 IC3.3
PWRLED  (via drill 0.35)
  Top 0.254: M2.12 331.63,60.02 331.63,83.25 331.64,83.26 331.64,83.99 332.42,84.77 336.23,84.77 337.03,83.98 v339.73,83.98 339.73,82.67 JP3.1
  Bottom 0.254: v339.73,83.98 338.3,83.98 337.95,84.33 R11.2
RGBOUT  (via drill 0.35)
  Top 0.254: M2.9 335.93,63.34 336.07,63.34 337,62.41 337,16.43 v337.05,16.39
  Bottom 0.254: v337.05,16.39 307.52,16.39 R16.1
ROW0  (via drill 0.35)
  Top 0.254: v324.66,89.24 324.66,87.02 326.07,85.61 v326.07,66.99 326.55,66.52 326.55,42.06 M1.B3 | v61.83,93.82 63.02,92.63 63.02,83.19 v63.34,82.87 | v81.76,83.5 81.79,83.54 81.79,89.73 83.03,90.96 v83.03,91.12 | v121.11,82.24 121.13,82.25 121.13,91.12 v121.44,91.12 | v140.65,82.39 140.65,93.34 140.97,93.66 v141.13,93.5 | v196.37,82.39 196.37,87.47 195.66,88.19 v195.66,89.3 | v234.24,82.15 234.24,87.87 v233.2,88.9 | v272.57,82.39 272.57,87.63 v271.14,89.06 | v310.2,82.39 310.2,85.15 310.27,85.22 310.27,88.83 v309.86,89.24 v309.85,89.24 | v351.63,73.18 351.72,73.18 352.27,73.73 356.87,73.73 359.25,71.35 v359.25,67.31
  Bottom 0.254: SW2.2 42.9,91.29 53.66,91.29 56.2,93.82 v61.83,93.82 | M1.B3 RN1.2 | v324.66,89.24 v309.85,89.24 309.85,90.57 SW16.2 | v63.34,82.87 81.12,82.87 v81.76,83.5 82.23,83.03 92.34,83.03 93.41,81.95 120.83,81.95 v121.11,82.24 121.27,82.24 121.6,81.92 138.77,81.92 138.79,81.94 139.34,81.94 139.36,81.92 140.18,81.92 v140.65,82.39 141.13,81.92 195.9,81.92 v196.37,82.39 196.53,82.39 197.01,81.92 234.16,81.92 234.31,82.07 v234.24,82.15 272.49,82.15 272.57,82.23 v272.57,82.39 v310.2,82.39 | v83.03,91.12 v83.03,91.13 SW4.2 | v121.44,91.12 SW6.2 | v141.13,93.5 141.4,93.77 156.1,93.77 157,92.87 157,91.16 SW8.2 | v195.66,89.3 195.66,90.53 SW10.2 | v233.2,88.9 233.2,91.06 SW12.2 | v271.14,89.06 271.22,89.13 SW14.2 | v351.63,73.18 351.63,71.75 349.64,69.76 347.96,69.76 345.19,66.99 v326.07,66.99 | v359.25,67.31 359.28,67.31 360.15,66.44 378.55,66.44 J1.12
ROW1  (via drill 0.35)
  Top 0.254: v329.88,50.96 329.72,50.8 329.72,39.56 RN1.3 | v24.75,88.22 24.75,82.41 25.08,82.07 v25.24,82.07 | v71.44,79.85 v71.44,73.98 | v109.38,79.53 111.6,77.31 v111.6,72.07 | v150.18,79.53 150.18,72.39 v149.86,72.07 | v183.83,79.69 183.83,75.56 v185.26,74.14 | v226.06,79.38 226.06,72.55 v225.58,72.07 | v264.16,79.38 264.16,72.23 v264,72.07 | v285.75,67.94 285.75,53.82 v286.54,53.02 | v364.17,57.31 v370.84,63.98
  Bottom 0.254: M1.B4 RN1.3 | J1.11 380.93,64.06 370.92,64.06 v370.84,63.98 | v24.75,88.22 23.7,89.27 SW1.2 | v25.24,82.07 51.12,82.07 53.34,79.85 v71.44,79.85 109.06,79.85 v109.38,79.53 109.7,79.85 128.13,79.85 128.16,79.83 149.88,79.83 v150.18,79.53 150.31,79.67 166.8,79.67 166.82,79.69 167.16,79.69 167.48,80.01 183.51,80.01 v183.83,79.69 205.58,79.69 205.76,79.51 206.65,79.51 206.67,79.53 225.9,79.53 v226.06,79.38 243.21,79.38 243.36,79.53 264,79.53 v264.16,79.38 | v71.44,73.98 71.44,72.14 SW20.2 | v111.6,72.07 SW22.2 | v149.86,72.07 SW24.2 | v185.26,74.14 185.26,72.44 SW26.2 | v225.58,72.07 SW28.2 | SW30.2 v264,72.07 264.8,72.87 273.05,72.87 277.18,68.74 285.12,68.74 285.75,68.1 v285.75,67.94 | v286.54,53.02 288.8,50.77 292.36,50.77 292.55,50.96 294.96,50.96 | 294.96,50.96 v329.88,50.96 331.63,52.7 339.88,52.7 341.79,54.61 341.79,55.4 342.58,56.2 353.69,56.2 354.81,57.31 v364.17,57.31 | SW48.2 294.98,50.98 294.96,50.96
ROW2  (via drill 0.35)
  Top 0.254: v363.48,39.43 363.35,39.56 363.35,52.92 378.3,67.87 J1.10 | v56.67,63.66 56.83,63.5 v56.83,54.93 | v95.25,63.82 95.25,55.56 v95.09,55.4 | v133.03,63.82 133.19,63.66 v133.19,54.93 | v171.29,64.14 171.29,55.24 v171.13,55.09 | v209.39,64.14 v209.39,55.09 | v246.7,63.98 247.01,63.66 v247.01,55.4 247.01,52.7 249.87,49.85 v249.87,40.48
  Bottom 0.254: v249.87,40.48 264,40.48 269.08,35.4 277.98,35.4 280.2,37.62 287.97,37.62 298.45,37.62 299.72,36.35 302.12,36.35 304.41,34.06 | v363.48,39.43 361.22,39.43 361,39.21 360.68,38.89 354.49,38.89 353.38,37.78 338.45,37.78 335.72,35.05 331.69,35.05 RN1.4 M1.B5 323.64,35.84 319.71,31.91 309.52,31.91 307.36,34.06 304.41,34.06 | SW18A.1 31.01,59.63 SW18.2 35.03,60.9 38.26,64.14 56.2,64.14 v56.67,63.66 57.15,64.14 94.93,64.14 v95.25,63.82 95.57,64.14 132.72,64.14 v133.03,63.82 151.45,63.82 151.61,63.98 152.72,63.98 152.88,63.82 170.97,63.82 v171.29,64.14 171.61,63.82 209.07,63.82 v209.39,64.14 209.71,63.82 246.54,63.82 v246.7,63.98 | v56.83,54.93 56.98,54.78 SW36.2 | v95.09,55.4 95.09,53.06 SW38.2 | v133.19,54.93 133.14,54.87 SW40.2 | v171.13,55.09 171.13,53.11 SW42.2 | v209.39,55.09 209.39,53.12 SW44.2 | v247.01,55.4 247.01,55.09 247.38,54.73 SW46.2 | 304.41,34.06 SW64.2
ROW3  (via drill 0.35)
  Top 0.254: v338.14,69.22 339.09,68.26 339.09,33.66 v338.14,32.7 338.14,21.75 338.45,21.43 v338.53,21.51 | v327.15,69.63 327.15,70.74 326.98,70.92 326.98,86.06 v326.52,86.52 | v100.97,88.58 101.6,87.95 v101.6,81.28 | v139.06,81.28 139.06,88.58 v138.59,89.06 | v177.01,81.12 177.01,88.11 v176.21,88.9 | v214.95,81.12 214.95,85.1 215.07,85.22 215.07,88.14 v214.15,89.06 | v253.37,81.44 253.37,87.79 v252.25,88.9 | v291.78,81.44 291.78,87.47 v290.35,88.9 | v341.76,70.83 342.11,70.83 343.08,71.8 346.12,71.8 348.62,74.3 357.66,74.3 v360.2,71.75
  Bottom 0.254: SW3.2 64.95,94.31 98.42,94.31 99.86,92.87 SW5.2 99.86,89.69 v100.97,88.58 | SW7.2 138.11,91.13 138.59,90.65 v138.59,89.06 | M1.B6 RN1.5 330.94,33.34 331.57,32.7 v338.14,32.7 | J1.5 380.93,71.68 360.28,71.68 v360.2,71.75 | v326.52,86.52 326.22,86.52 324.12,88.62 310.87,88.62 310.36,88.11 305.59,88.11 304.83,88.87 304.8,88.87 304.61,89.06 302.58,89.06 300.51,91.13 290.35,91.13 | v327.15,69.63 334.55,69.63 334.96,69.22 v338.14,69.22 340.65,69.22 341.76,70.33 341.76,70.48 v341.76,70.83 | v176.21,88.9 176.21,90.93 SW9.2 | v101.6,81.28 v139.06,81.28 139.7,81.28 139.86,81.12 v177.01,81.12 v214.95,81.12 253.05,81.12 v253.37,81.44 253.68,81.12 291.46,81.12 v291.78,81.44 | v214.15,89.06 214.15,91.07 SW11.2 | v252.25,88.9 252.25,91.05 SW13.2 | 290.35,91.13 SW15.2 | v290.35,88.9 290.35,91.13 | SW65.2 357.66,21.53 SW65A.1 346.54,21.51 v338.53,21.51
ROW4  (via drill 0.35)
  Top 0.254: v361.79,79.38 361.79,79.22 361.83,79.17 v361.83,70.41 362.94,69.3 362.94,59.62 358.77,55.45 358.77,48.97 354.99,45.19 353.7,45.19 349.77,41.26 348.43,41.26 348.42,41.27 348.3,41.27 341.83,34.81 v341.83,33.87 | v326.12,17.96 326.11,17.97 326.11,29.18 M1.B7 | v66.52,37.31 66.52,43.34 v66.99,43.81 | v104.62,43.5 v104.62,36.04 | v142.72,43.66 v142.72,36.04 142.72,31.43 147.48,26.67 v147.48,17.14 | v180.66,43.66 v180.66,35.88 | v218.76,44.11 218.76,35.88 220.66,33.97 v220.82,33.97 | v247.17,43.97 247.17,22.07 v246.7,21.59 | v268.61,18.41 268.61,22.23 v267.97,22.86
  Bottom 0.152: v361.79,79.38 361.31,79.86
  Bottom 0.254: M1.B7 RN1.6 331.5,31.36 338.69,31.36 341.19,33.87 v341.83,33.87 | v361.83,70.41 J1.8 | v326.12,17.96 326.1,17.93 305.6,17.93 304.64,18.89 269.08,18.89 v268.61,18.41 | SW52.2 66.5,37.29 v66.52,37.31 | v66.99,43.81 104.3,43.81 v104.62,43.5 104.93,43.81 142.56,43.81 v142.72,43.66 142.88,43.81 180.5,43.81 v180.66,43.66 181.29,44.29 218.6,44.29 218.76,44.13 v218.76,44.11 218.94,44.29 246.86,44.29 v247.17,43.97 | v104.62,36.04 104.62,34.02 SW54.2 | v142.72,36.04 142.72,34.04 SW56.2 | SW66.2 v147.48,17.14 | v180.66,35.88 180.66,34.06 SW58.2 | v220.82,33.97 SW60.2 | v246.7,21.59 252.97,21.59 SW62A.1 264.13,21.53 SW62.2 265.46,22.86 v267.97,22.86 | SW17A.1 354.91,78.68 356.18,79.95 358.77,79.95 | 358.77,79.95 SW17.2 | 361.31,79.86 361.21,79.95 358.77,79.95
ROW5  (via drill 0.35)
  Top 0.254: v71.25,38.37 71.28,38.37 77.95,45.03 v77.95,53.03 77.95,62.71 v77.31,63.34 | v114.14,63.34 v114.14,54.93 | v152.08,63.02 152.08,55.24 v152.24,55.09 | v190.34,62.87 v190.34,54.93 | v228.44,62.87 v228.44,55.09 | v266.38,62.87 v266.38,55.09 | v324.17,28.1 323.85,28.42 v323.85,41.91 323.85,48.58 325.44,50.16 v325.44,51.62 | v362.21,68.56 362.14,68.49 362.14,62.27 v362.11,62.23 | v341,56.04 v341,59.37
  Bottom 0.254: SW37.2 v77.95,53.03 | v71.25,38.37 57.57,38.37 54.98,40.96 43.66,40.96 39.85,37.15 18.41,37.15 18.41,34.46 SW50.2 | RN1.7 M1.B8 324.29,28.22 v324.17,28.1 | J1.7 380.83,69.04 362.69,69.04 v362.21,68.56 | SW33A.1 346.56,59.85 | 346.56,59.85 346.56,60.79 347.5,59.85 355.76,59.85 356.87,60.96 358.87,60.96 | v77.31,63.34 94.46,63.34 94.77,63.02 95.89,63.02 96.2,63.02 96.84,63.66 113.82,63.66 v114.14,63.34 132.24,63.34 132.56,63.02 v152.08,63.02 190.18,63.02 v190.34,62.87 190.5,63.02 228.28,63.02 v228.44,62.87 228.6,63.02 266.22,63.02 v266.38,62.87 | v114.14,54.93 114.14,53.08 SW39.2 | v152.24,55.09 152.24,53.09 SW41.2 | v190.34,54.93 190.34,53.12 SW43.2 | v228.44,55.09 228.44,53.13 SW45.2 | v266.38,55.09 266.38,53.18 266.06,52.86 266.25,52.86 SW47.2 266.42,49.97 268.45,47.94 271.37,45.02 306.46,45.02 309.25,42.23 323.53,42.23 v323.85,41.91 | 358.87,60.96 SW33.2 | v362.11,62.23 361.79,61.91 358.77,61.91 358.77,61.06 358.87,60.96 | v325.44,51.62 327,53.18 339.41,53.18 341,54.77 v341,56.04 | v341,59.37 341.47,59.85 346.56,59.85
ROW6  (via drill 0.35)
  Top 0.254: v272.1,28.26 272.1,30.32 272.57,30.8 272.57,46.67 283.21,57.31 v283.21,72.07 283.53,72.39 v283.53,79.85 | v374.64,73.05 373.06,71.46 373.06,67.66 361.77,56.37 361.77,54.34 361.79,54.31 361.79,42.7 v361.16,42.07 | v54.29,72.07 v54.29,80.96 | v90.49,80.96 92.55,78.9 v92.55,72.07 | v128.43,80.49 v128.43,73.98 | v166.53,80.33 168.59,78.26 v168.59,72.23 | v206.38,80.17 206.69,79.85 v206.69,72.07 | v242.09,80.17 242.41,79.85 v242.41,73.98 | v344.33,27.62 346.07,29.37 346.07,30.3 346.55,30.77 346.55,38.36 v348.77,40.58
  Bottom 0.254: v344.33,27.62 342.39,25.68 RN1.8 M1.B9 326.38,26.99 309.56,26.99 308.29,25.72 294.42,25.72 293.78,26.35 284.8,26.35 283.69,25.24 275.12,25.24 v272.1,28.26 | J1.6 379.56,73.05 v374.64,73.05 | SW19.2 v54.28,72.08 v54.29,72.07 | v54.29,80.96 v90.49,80.96 100.49,80.96 100.97,80.49 v128.43,80.49 166.37,80.49 v166.53,80.33 166.69,80.49 176.71,80.49 176.73,80.46 206.08,80.46 v206.38,80.17 v242.09,80.17 283.21,80.17 v283.53,79.85 | v92.55,72.07 SW21.2 | v128.43,73.98 128.5,73.91 SW23.2 | v168.59,72.23 166.73,72.23 SW25.2 | v206.69,72.07 SW27.2 | v242.41,73.98 242.74,73.65 SW29.2 | v283.21,72.07 281.15,72.07 280.99,71.91 280.98,71.91 SW31.2 | SW49A.1 v348.77,40.58 357.66,40.58 SW49.2 360.94,41.85 v361.16,42.07
ROW7  (via drill 0.35)
  Top 0.254: v18.9,50.76 20.36,49.3 20.36,36.51 v20.1,36.25 | v29.25,29.33 29.41,29.33 31.11,27.62 v31.11,26.05 | v31.11,26.05 31.11,26.04 v31.11,26.05 | v373.45,23.14 373.38,23.22 373.38,61.24 378.74,66.6 380.93,66.6 J1.9 | v289.08,32.23 289.08,27.83 291.41,25.5 v291.56,25.5 | v87.71,26.27 v87.71,33.97 87.71,44.53 v87.79,44.61 | v123.67,44.61 v123.67,43.02 v123.67,35.88 | v161.45,42.7 v161.45,36.04 | v201.61,33.97 v201.61,42.7 | v239.87,43.34 v239.87,33.97 | v260.99,43.02 267.02,36.99 267.02,28.57 v271.78,23.81
  Bottom 0.254: Q3.3 30.64,26.52 v31.11,26.05 31.11,24.49 SW51A.1 45.17,21.53 SW51.2 49.35,25.72 87.31,25.72 87.79,26.19 v87.71,26.27 | v20.1,36.25 22.33,36.25 v29.25,29.33 | v373.45,23.14 373.45,22.62 370.36,19.53 334.49,19.53 330.9,23.11 RN1.9 M1.B10 327.65,23.14 326.35,24.45 294.92,24.45 293.87,25.5 v291.56,25.5 289.87,23.81 v271.78,23.81 | v18.9,50.76 | v18.9,50.76 SW34.2 | SW53.2 v87.71,33.97 | v87.79,44.61 v123.67,44.61 | v123.67,35.88 123.67,34.03 SW55.2 | v123.67,43.02 141.6,43.02 141.76,42.86 161.29,42.86 v161.45,42.7 161.61,42.86 201.45,42.86 v201.61,42.7 202.72,43.81 217.81,43.81 218.28,43.34 219.39,43.34 219.87,43.81 239.4,43.81 v239.87,43.34 240.19,43.02 v260.99,43.02 | v161.45,36.04 161.45,34.23 SW57.2 | SW59.2 v201.6,33.98 v201.61,33.97 | v239.87,33.97 SW61.2 | v289.08,32.23 289.08,33.34 288.44,33.98 SW63.2
RX  (via drill 0.35)
  Top 0.254: v328.45,85.09 328.45,90.59 J6.2
  Bottom 0.254: M2.2 331.96,85.09 v328.45,85.09
SCL  (via drill 0.35)
  Top 0.254: v325.3,73.18 321.31,69.2 321.31,52.23 M1.C4 321.34,52.1 319.4,50.16 319.4,12.38 v319.56,12.22
  Bottom 0.254: R13.1 333.59,73.3 M2.6 333.33,73.18 v325.3,73.18 | J7.1 381.97,26.21 379.25,23.5 371.63,15.88 371.63,14.13 365.6,8.1 362.11,8.1 321.79,8.1 320.2,9.68 320.2,11.59 v319.56,12.22
SDA  (via drill 0.35)
  Top 0.254: v324.59,75.68 320.72,71.81 320.72,54.04 318.88,52.2 M1.C3 318.8,11.4 v319.09,11.11
  Bottom 0.254: R12.1 333.61,76 M2.5 333.29,75.68 v324.59,75.68 | J7.2 382.06,23.81 380.84,23.81 380.52,23.81 372.27,15.56 372.27,13.97 365.8,7.5 321.43,7.5 319.56,9.37 319.56,10.64 v319.09,11.11
SHIFTLOCK  (via drill 0.35)
  Top 0.254: v26.99,13.02 26.99,20.8 v26.83,20.95 26.83,38.58 v27.15,38.89
  Bottom 0.254: IC1.5 27.2,13.07 27.15,13.02 v26.99,13.02 | v26.83,20.95 26.77,20.9 D1.A | v27.15,38.89 27.27,39.02 R2.2
SND_OUT  (via drill 0.35)
  Top 0.254: M2.8 337.98,63.83 337.98,35.24 v338.3,34.92
  Bottom 0.254: v338.3,34.92 340.68,37.31 353.69,37.31 354.74,38.35 358.21,38.35 358.81,37.75 R18.2
TX
  Bottom 0.254: M2.1 329.27,86.07 329.25,86.04 325.75,89.53 325.75,90.45 J6.3

## Text on the board
Bottom: 225/02
tNames: DNP | Close JP3 only / if no Pro Micro / is installed! | +5V | A3 | TX | RX | GND | 1.5U | 1.5U | 1.5U | 1.5U | screw mount / stabilizer 2U | 2U | 1.5U | SCL | SDA | I²C | +5V | 1.5U | 1.5U | 1.5U | GND | 9U | screw mount / stabilizer 7U | 9U | 7U | 7U | Rev.2 | Hot / Swap | http://github.com/ / svenpetersen1965 | 7U
bNames: + | 1 | - | PWR LED | + | PWR LED | + | - | + | 1 | KEYBOARD | + | - | µC Circuit | Configure M1: / A[0..2] = GND | Speaker Circuit | 1 | SCL | SDA | I²C | RGB LED Circuit | +5V | POR | 1 | GND | KERNAL / SELECT | GND | 1 | (uFreeze) A13 | DOUT | (uMenu) A14 | +5V | 1 | (uReset) A15 | GND | Jumper | !C64_RESET | RGB LEDs / WS2812B | !EXROM | Close for / ASSY 250469 | Shift Lock Circuit
Document: 225-2-01-02 | Sven Petersen / 2026 | 35µ | 2 | 2